# EAGLE design main (EAGLE 7.7.0)
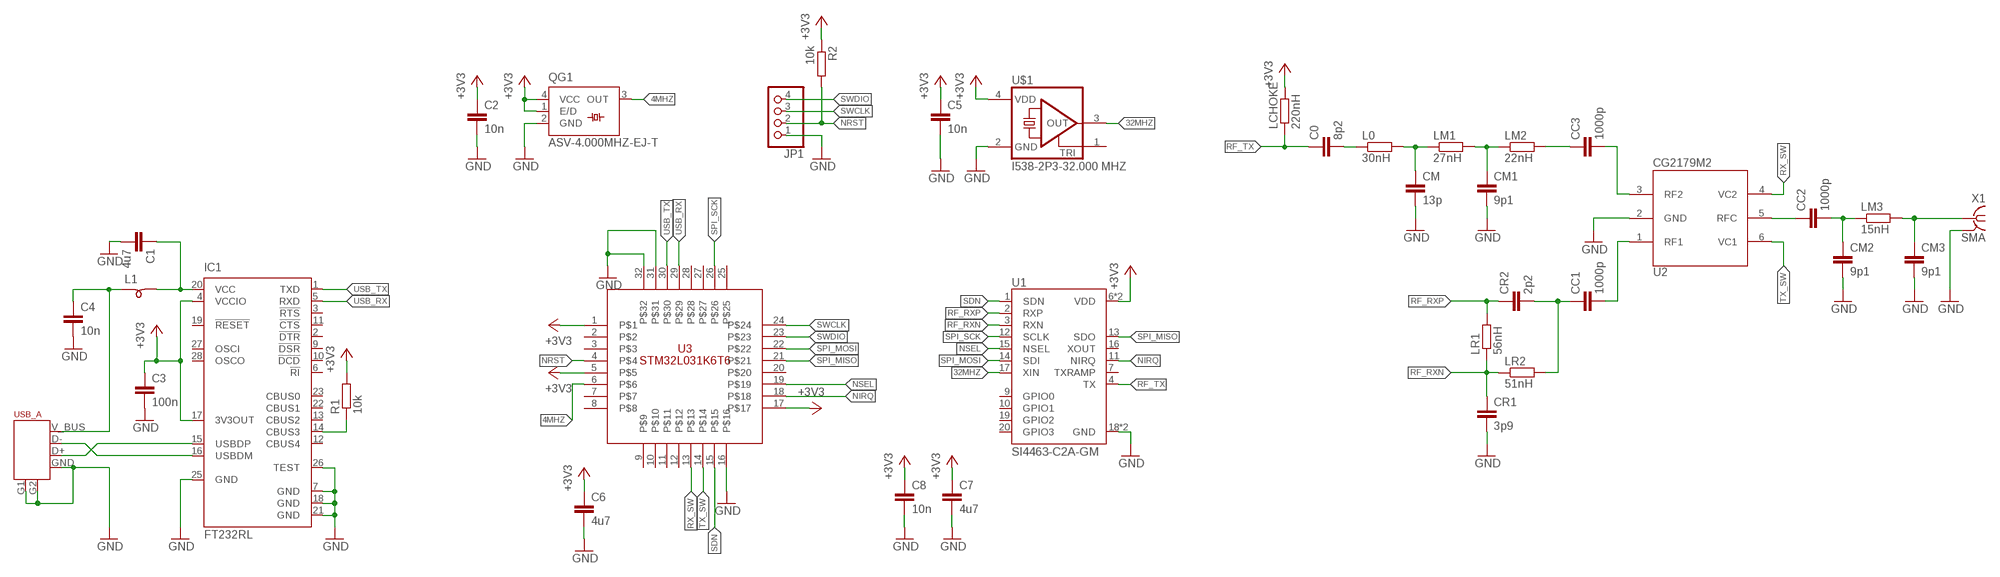
[diagram p0: schematic, sheet 1]

## Parts
C0  8p2  C-EUC0805  [C0805]
C1  4u7  C-EUC1206  [C1206]
C2  10n  C-EUC0805  [C0805]
C3  100n  C-EUC0805  [C0805]
C4  10n  C-EUC0805  [C0805]
C5  10n  C-EUC0805  [C0805]
C6  4u7  C-EUC1206  [C1206]
C7  4u7  C-EUC1206  [C1206]
C8  10n  C-EUC0805  [C0805]
CC1  1000p  C-EUC0805  [C0805]
CC2  1000p  C-EUC0805  [C0805]
CC3  1000p  C-EUC0805  [C0805]
CM  13p  C-EUC0805  [C0805]
CM1  9p1  C-EUC0805  [C0805]
CM2  9p1  C-EUC0805  [C0805]
CM3  9p1  C-EUC0805  [C0805]
CR1  3p9  C-EUC0805  [C0805]
CR2  2p2  C-EUC0805  [C0805]
IC1  FT232RL  [SSOP28]
JP1  PINHD-1X4  [1X04]
L0  30nH  R-EU_R0805  [R0805]
L1  SM-B5  [SM-B5]
LCHOKE  220nH  R-EU_R0805  [R0805]
LM1  27nH  R-EU_R0805  [R0805]
LM2  22nH  R-EU_R0805  [R0805]
LM3  15nH  R-EU_R0805  [R0805]
LR1  56nH  R-EU_R0805  [R0805]
LR2  51nH  R-EU_R0805  [R0805]
QG1  ASV-4.000MHZ-EJ-T  SM77H  [SM77H]
R1  10k  R-EU_R0805  [R0805]
R2  10k  R-EU_R0805  [R0805]
U1  SI4463-C2A-GM  [QFN50P400X400X90-20N]
U2  CG2179M2  [SOT363]
U3  STM32L031K6T6  STM32L011  [LQFP32-7X7]
U$1  I538-2P3-32.000 MHZ  ASE  [ASE]
U$2  USB_TYPE_A  [USB_A_THT]
X1  SMA  SMA-142-0711-821/826  [J502-ND-142-0711-821/826]

## Nets
4MHZ: QG1.3(OUT) U3.6
32MHZ: U1.17(XIN) U$1.3(OUT)
+3V3: C2.1 C3.1 C5.1 C6.1 C7.1 C8.1 IC1.4(VCCIO) IC1.17(3V3OUT) LCHOKE.2 QG1.1(E/D) QG1.4(VCC) R1.2 R2.1 U1.6(VDD) U1.8(VDD) U3.1 U3.5 U3.17 U$1.4(VDD)
GND: C1.2 C2.2 C3.2 C4.2 C5.2 C6.2 C7.2 C8.2 CM1.2 CM2.2 CM3.2 CM.2 CR1.2 IC1.7(GND) IC1.18(GND) IC1.21(GND) IC1.25(GND) IC1.26(TEST) JP1.1 QG1.2(GND) U1.18(GND) U1.21(GND) U2.2(GND) U3.16 U3.31 U3.32 U$1.2(GND) U$2.G1 U$2.G2 U$2.GND X1.G@1 X1.G@2 X1.G@3 X1.G@4
N$2: CC3.1 LM2.2
N$3: IC1.15(USBDP) U$2.D+
N$4: IC1.16(USBDM) U$2.D-
N$5: C4.1 L1.1 U$2.V_BUS
N$6: C1.1 IC1.20(VCC) L1.2
N$8: IC1.14(CBUS3) R1.1
N$9: CC3.2 U2.3(RF2)
N$21 [rf]: CM3.1 LM3.2 X1.1
N$22 [rf]: CC2.2 CM2.1 LM3.1
N$23 [rf]: C0.2 L0.1
N$24 [rf]: CM.1 L0.2 LM1.1
N$25 [rf]: CM1.1 LM1.2 LM2.1
N$29: CC1.1 CR2.2 LR2.2
N$31: CC1.2 U2.1(RF1)
N$32 [rf]: CC2.1 U2.5(RFC)
NIRQ: U1.11(NIRQ) U3.18
NRST: JP1.2 R2.2 U3.4
NSEL: U1.15(NSEL) U3.19
RF_RXN: CR1.1 LR1.1 LR2.1 U1.3(RXN)
RF_RXP: CR2.1 LR1.2 U1.2(RXP)
RF_TX: C0.1 LCHOKE.1 U1.4(TX)
RX_SW: U2.4(VC2) U3.13
SDN: U1.1(SDN) U3.15
SPI_MISO: U1.13(SDO) U3.21
SPI_MOSI: U1.14(SDI) U3.22
SPI_SCK: U1.12(SCLK) U3.26
SWCLK: JP1.3 U3.24
SWDIO: JP1.4 U3.23
TX_SW: U2.6(VC1) U3.14
USB_RX: IC1.5(RXD) U3.29
USB_TX: IC1.1(TXD) U3.30
Unconnected: IC1.2(!DTR) IC1.3(!RTS) IC1.6(!RI) IC1.9(!DSR) IC1.10(!DCD) IC1.11(!CTS) IC1.12(CBUS4) IC1.13(CBUS2) IC1.19(!RESET) IC1.22(CBUS1) IC1.23(CBUS0) IC1.27(OSCI) IC1.28(OSCO) U1.7(TXRAMP) U1.9(GPIO0) U1.10(GPIO1) U1.16(XOUT) U1.19(GPIO2) U1.20(GPIO3) U3.2 U3.3 U3.7 U3.8 U3.9 U3.10 U3.11 U3.12 U3.20 U3.25 U3.27 U3.28 U$1.1(TRI)

## Library data of the parts
C0 C1-C8 CC1-CC3 CM CM1-CM3 CR1 CR2 = rcl:C-EU: CAPACITOR, European symbol
IC1 = ftdichip:FT232R: Source: http://www.ftdichip.com/Documents/DataSheets/DS_FT232R_v104.pdf; MPN: FT232RL; OC_FARNELL: 1146032; OC_NEWARK: 91K9918
JP1 = pinhead:PINHD-1X4: PIN HEADER
L0 LCHOKE LM1-LM3 LR1 LR2 R1 R2 = resistor:R-EU_: RESISTOR, European symbol
L1 = inductor-neosid:SM-B: INDUCTOR SMD Bead inductor; OC_FARNELL: unknown; OC_NEWARK: unknown
QG1 = crystal:SM77H: 3.3V CMOS Clock Oscillator Source: www.pletronics.com .. sm77h%203.3v.pdf; OC_FARNELL: unknown; OC_NEWARK: unknown
U1 = SI4463-C2A-GM:SI4463-C2A-GM: RF Transceiver FSK/GFSK/GMSK/MSK/OOK 3.3V 20-Pin QFN EP; AVAILABILITY: Unavailable; DESCRIPTION: RF Transceiver FSK/GFSK/GMSK/MSK/OOK 3.3V 20-Pin QFN EP; MF: Silicon Labs; MP: SI4463-C2A-GM; PACKAGE: VFQFN-20 Silicon Labs; PRICE: None
U2 = CG2179M2:CG2179M2
U3 = STM32L011:STM32L011
U$1 = crystal:ASE: 3.3Vdc CMOS SMD CRYSTAL CLOCK OSCILLATOR SOurce: www.abracon.com; OC_FARNELL: unknown; OC_NEWARK: unknown
U$2 = USB_A:USB_TYPE_A
X1 = con-coax:SMA-: SMA 50 Ohm End Launch Jack Receptacle - Round Contact Johnson Components Source: www.johnsoncomponents.com .. J502-ND.pdf; MF: JOHNSON COMPONENTS; MPN: 142-0711-821; OC_FARNELL: 1019328; OC_NEWARK: 16F3627

## Net classes
1 pwr: width 0.5 mm, drill 0.2 mm, clearance 0.127 mm
2 rf: width 0.5 mm, drill 0.2 mm, clearance 0.127 mm

## Board
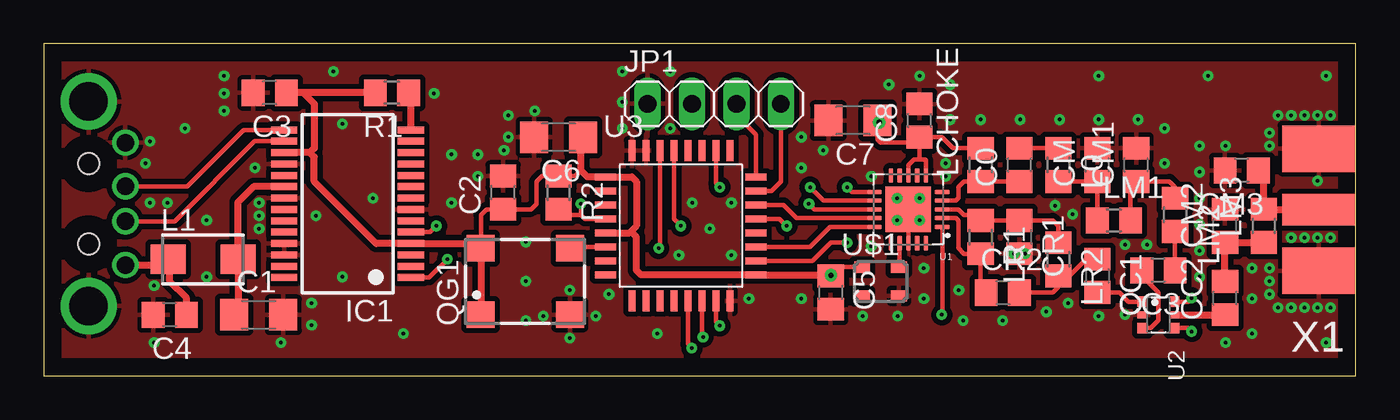
[diagram p1: board, top side]
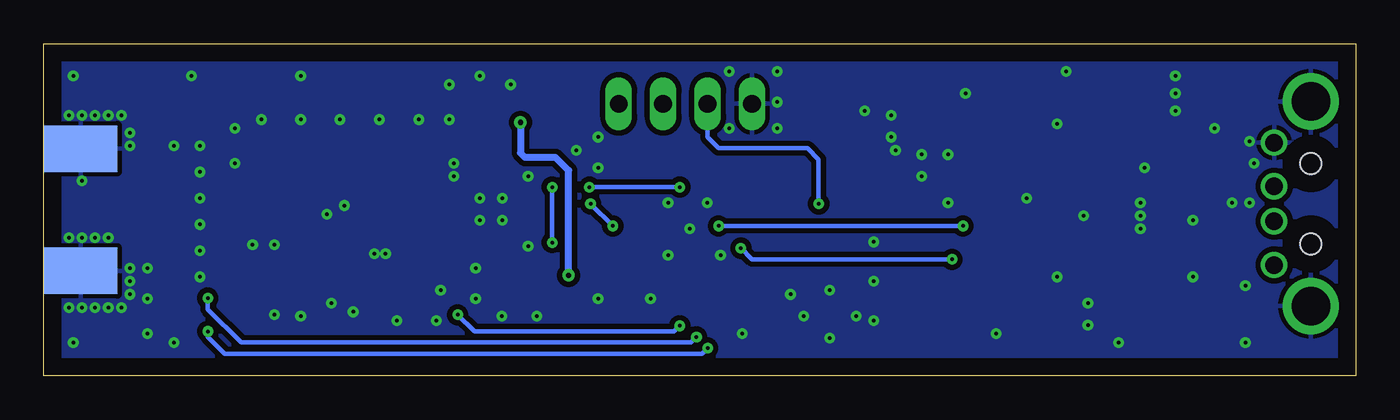
[diagram p2: board, bottom side, seen from below]

Size 75 x 19 mm. Coordinates in mm from the lower left corner, seen from the top.
Outline: 0,0 75,0 75,19 0,19 0,0
Copper layers (1*16): Top 0.035mm / dielectric 1.5mm / Bottom 0.035mm
Design rules "default *": minimum track width 10mil, minimum drill 24mil, track to track 8mil, track to pad 8mil, pad to pad 8mil, via to via 8mil, smd to smd 8mil, copper to edge 40mil, drill to drill 8mil, minimum pad ring 10mil, minimum via ring 8mil, stop-mask expansion 4mil, vias tented up to drill 0.3mm, thermal gap 10mil

### Footprints (pad centres in the part's own frame; a part is rotated, then mirrored left to right if it is on the bottom)
C0805 = smd 1.3 x 1.5: 1 -0.95,0; 2 0.95,0
C1206 = smd 1.6 x 1.8: 1 -1.4,0; 2 1.4,0
SSOP28 = smd 0.4 x 1.5: 1 -4.225,-3.625; 2 -3.575,-3.625; 3 -2.925,-3.625; 4 -2.275,-3.625; 5 -1.625,-3.625; 6 -0.975,-3.625; 7 -0.325,-3.625; 8 0.325,-3.625; 9 0.975,-3.625; 10 1.625,-3.625; 11 2.275,-3.625; 12 2.925,-3.625; 13 3.575,-3.625; 14 4.225,-3.625; 15 4.225,3.625; 16 3.575,3.625; 17 2.925,3.625; 18 2.275,3.625; 19 1.625,3.625; 20 0.975,3.625; 21 0.325,3.625; 22 -0.325,3.625; 23 -0.975,3.625; 24 -1.625,3.625; 25 -2.275,3.625; 26 -2.925,3.625; 27 -3.575,3.625; 28 -4.225,3.625
1X04 = drill 1.016 long: 1 -3.81,0; 2 -1.27,0; 3 1.27,0; 4 3.81,0
R0805 = smd 1.3 x 1.5: 1 -0.95,0; 2 0.95,0
SM-B5 = smd 2 x 1.7: 1 -2,0; 2 2,0
SM77H = smd 1.6 x 1.5: 1 -2.55,-1.9; 2 2.55,-1.9; 3 2.55,1.9; 4 -2.55,1.9
QFN50P400X400X90-20N = smd 0.84 x 0.26: 1 -1.935,1; 2 -1.935,0.5; 3 -1.935,0; 4 -1.935,-0.5; 5 -1.935,-1; 11 1.935,-1; 12 1.935,-0.5; 13 1.935,0; 14 1.935,0.5; 15 1.935,1 | smd 0.26 x 0.84: 6 -1,-1.935; 7 -0.5,-1.935; 8 0,-1.935; 9 0.5,-1.935; 10 1,-1.935; 16 1,1.935; 17 0.5,1.935; 18 0,1.935; 19 -0.5,1.935; 20 -1,1.935 | smd 2.6 x 2.6: 21 0,0
SOT363 = smd 0.6 x 0.6: 1 -0.75,-0.9; 3 0.75,-0.9; 4 0.75,0.9; 6 -0.75,0.9 | smd 0.4 x 0.6: 2 0,-0.9; 5 0,0.9
LQFP32-7X7 = smd 1.2 x 0.4: 1 -4.3,2.8; 2 -4.3,2; 3 -4.3,1.2; 4 -4.3,0.4; 5 -4.3,-0.4; 6 -4.3,-1.2; 7 -4.3,-2; 8 -4.3,-2.8; 17 4.3,-2.8; 18 4.3,-2; 19 4.3,-1.2; 20 4.3,-0.4; 21 4.3,0.4; 22 4.3,1.2; 23 4.3,2; 24 4.3,2.8 | smd 0.4 x 1.2: 9 -2.8,-4.3; 10 -2,-4.3; 11 -1.2,-4.3; 12 -0.4,-4.3; 13 0.4,-4.3; 14 1.2,-4.3; 15 2,-4.3; 16 2.8,-4.3; 25 2.8,4.3; 26 2,4.3; 27 1.2,4.3; 28 0.4,4.3; 29 -0.4,4.3; 30 -1.2,4.3; 31 -2,4.3; 32 -2.8,4.3
ASE = smd 0.9 x 0.65: 1 -1.05,-0.825; 2 1.05,-0.825; 3 1.05,0.825; 4 -1.05,0.825
USB_A_THT = drill 1: D+ -1,0; D- 1,0; GND -3.5,0; V_BUS 3.5,0 | drill 2.2: G1 -5.85,-2.1; G2 5.85,-2.1 | hole 1.2: -2.3,-2.1; 2.3,-2.1
J502-ND-142-0711-821/826 = smd 4.191 x 1.778: 1 2.115,0 | smd 4.191 x 2.667: G@1 2.115,3.495; G@2 2.115,-3.495 | smd 4.191 x 2.667 bottom: G@3 2.115,3.495; G@4 2.115,-3.495

### Placement (x,y rotation side)
C0  55.78,12.06 90 top
C1  12.29,3.49 0 top
C2  26.26,10.48 90 top
C3  12.92,16.19 180 top
C4  7.21,3.49 180 top
C5  44.98,4.76 270 top
C6  29.43,13.65 180 top
C7  46.25,14.61 180 top
C8  50.06,14.61 90 top
CC1  60.22,5.71 270 top
CC2  67.53,4.45 90 top
CC3  63.72,6.03 180 top
CM  60.22,12.06 90 top
CM1  62.45,12.06 90 top
CM2  67.53,8.57 90 top
CM3  68.48,11.75 180 top
CR1  55.78,7.94 270 top
CR2  54.83,4.76 0 top
IC1  17.37,9.84 90 top
JP1  38.32,15.56 0 top
L0  58,12.06 270 top
L1  9.11,6.67 0 top
LCHOKE  53.55,12.06 90 top
LM1  61.17,8.89 0 top
LM2  64.67,9.21 270 top
LM3  69.75,8.57 90 top
LR1  53.55,7.94 270 top
LR2  58,6.67 270 top
QG1  27.53,5.4 0 top
R1  19.91,16.19 180 top
R2  29.43,10.48 270 top
U1  49.43,9.53 180 top
U2  63.72,3.49 270 top
U3  36.42,8.57 0 top
U$1  47.84,5.4 0 top
U$2  4.67,9.84 270 top
X1  75,9.5 180 top

### Tracks (layer width: path | path; a pad name or v marks a point on that pad's centre or on a via)
4MHZ
  Top 0.254: U3.6 30.15,7.37 QG1.3
32MHZ
  Top 0.254: U1.17 48.93,6.26 U$1.3
+3V3  (via drill 0.3 pad 0.25)
  Top 0.254: 30.7,11.75 30.38,11.43 R2.1 28.48,11.43 28.16,11.11 28.16,9.84 27.85,9.53 C2.1 25.31,9.53 24.99,9.21 QG1.4 | U1.8 49.43,12.06 49.74,12.38 50.06,12.38 | U1.6 50.43,12.34 50.38,12.38 50.06,12.38 | C8.1 50.06,12.38 | C7.1 47.65,13.52 47.84,13.34 49.74,13.34 C8.1 | LCHOKE.2 51.97,13.02 51.33,13.65 C8.1 | U$1.4 45.49,6.22 C5.1 44.92,5.77
  Top 0.406: 15.21,12.77 15.46,13.02 15.46,15.56 14.83,16.19 | 15.21,12.77 IC1.17 | 15.21,12.77 15.46,12.52 15.46,11.11 19.01,7.57 IC1.4 24.71,7.57 QG1.4 | 14.83,16.19 C3.1 | R1.2 14.83,16.19 | C6.1 30.7,13.52 30.7,11.75 31.08,11.37 U3.1 33.62,11.37 33.88,11.11 33.88,8.57 33.56,8.26 | U3.5 33.48,8.17 33.56,8.26 | QG1.4 QG1.1 | 33.56,8.26 33.88,7.94 33.88,6.03 34.14,5.77 U3.17 44.92,5.77 | v47.75,14.5 v47.75,14.51 C7.1 | C5.1 44.98,5.73 v45,5.75
  Bottom 0.406: v45,5.75 45,11.75 45.75,12.5 47.5,12.5 47.75,12.75 v47.75,14.5
GND  (via drill 0.2 pad 0.25)
  Top 0.254: U1.18 U1.21 v50.06,8.89
  other vias: 55.46,6.99 56.09,6.99 61.81,3.49 48.79,10.16 50.06,10.16 48.79,8.89 72.81,3.91 73.56,3.91 72.06,3.91 71.31,3.91 70.56,3.91 70.06,4.66 70.06,5.41 70.06,6.16 71.31,7.91 73.56,7.91 72.81,7.91 72.06,7.91 73.56,14.91 72.81,14.91 72.06,14.91 71.31,14.91 70.56,14.91 70.06,13.16 70.06,13.91 72.81,11.16 67.56,13.16 66.06,11.66 66.06,13.16 66.06,10.16 66.06,8.66 66.06,7.16 66.06,5.66 69.06,6.16 69.06,4.41 69.06,2.41 67.56,1.91 60.31,3.41 58.56,4.16 57.31,3.66 54.81,3.16 52.56,3.16 52.31,4.91 61.81,7.49 63.06,7.49 58.81,9.24 57.81,9.74 50.31,6.16 50.31,4.41 48.81,3.41 46.81,3.41 47.31,7.41 47.31,11.41 51.56,11.41 51.56,12.16 64.06,12.16 62.56,14.66 60.31,14.66 58.06,14.66 55.81,14.66 53.56,14.66 51.81,14.66 64.06,14.16 50.06,17.16 51.81,16.66 48.31,16.66 43.31,13.66 44.56,12.91 43.31,11.91 33.06,17.41 35.81,17.41 33.06,14.16 35.81,14.16 28.06,15.16 26.56,13.66 26.56,14.91 26.31,12.91 24.81,11.41 24.81,12.66 23.31,9.91 23.31,12.66 22.31,16.16 16.56,17.41 17.06,14.41 18.81,10.16 15.56,9.16 17.06,5.66 6.06,13.41 5.81,12.16 10.31,16.16 8.06,14.16 10.31,17.16 10.31,15.16 12.06,11.91 9.31,8.91 9.31,5.66 6.31,1.91 13.56,1.91 6.31,5.16 15.31,4.16 15.31,2.91 20.56,2.41 12.31,9.16 12.31,8.41 12.31,9.91 30.06,2.16 28.56,3.41 31.56,3.41 30.06,4.91 27.56,7.66 32.31,4.66 27.56,3.16 27.56,5.41 35.06,2.41 40.31,4.41 43.31,4.41 36.31,6.91 39.31,6.91 38.06,8.41 39.31,9.91 37.06,9.91 33.06,15.66 73.31,17.16 60.31,17.16 66.56,17.16 73.31,1.91 6.06,9.91 7.06,9.91
  pour Top (isolate 0.3): -0.5,-0.5 75.25,-0.5 75.25,19.5 -0.5,19.5
  pour Bottom (isolate 0.3): -0.5,19.5 75.25,19.5 75.25,-0.5 -0.5,-0.5
N$2
  Top 0.254: LM2.2 CC3.1
N$3
  Top 0.254: IC1.15 11.43,14.07 8.21,10.84 U$2.D+
N$4
  Top 0.254: IC1.16 12.05,13.42 7.48,8.84 U$2.D-
N$5
  Top 0.406: U$2.V_BUS 6.79,6.34 L1.1 7.21,6.57 7.21,5.4 8.16,4.45 C4.1
N$6
  Top 0.406: C1.1 11.11,3.72 L1.2 11.11,9.94 11.99,10.82 IC1.20
N$8
  Top 0.406: IC1.14 20.99,16.06 R1.1
N$9
  Top 0.254: CC3.2 62.77,5.71 63.72,4.76 63.72,3.17 63.28,2.74 U2.3
N$21
  Top 0.254: 69.75,11.43 CM3.1
  Top 0.406: 69.75,11.43 LM3.2 72.86,9.52 X1.1
N$22
  Top 0.406: CC2.2 CM2.1 LM3.1
N$23
  Top 0.254: C0.2 L0.1
N$24
  Top 0.254: L0.2 CM.1 LM1.1
N$25
  Top 0.254: LM1.2 62.12,10.79 CM1.1 64.35,11.12 64.67,10.79 LM2.1
N$29
  Top 0.254: CC1.1 59.59,6.67 58.63,5.71 LR2.2 58,5.08 57.68,4.76 CR2.2
N$31
  Top 0.254: U2.1 62.01,4.24 61.49,4.76 CC1.2
N$32
  Top 0.254: CC2.1
  Top 0.406: U2.5 CC2.1
NIRQ  (via drill 0.2 pad 0.25)
  Top 0.254: U3.18 43.94,6.57 44.99,7.62 v45.94,7.62 | U1.11 46.2,10.53 v45.94,10.79
  Bottom 0.254: v45.94,10.79 v45.94,7.62
NRST  (via drill 0.2 pad 0.25)
  Top 0.254: U3.4 30.94,8.97 30.7,9.21 | 30.7,9.21 v30.7,9.84 | 30.7,9.21 29.75,9.21 R2.2
  Bottom 0.254: JP1.2 37.05,13.65 36.42,13.02 31.34,13.02 30.7,12.38 v30.7,9.84
NSEL
  Top 0.254: U1.15 44.94,8.53 43.79,7.37 U3.19
RF_RXN
  Top 0.254: LR2.1 58,8.57 57.69,8.89 CR1.1 LR1.1 53.23,9.21 52.6,9.21 52.28,9.53 U1.3
RF_RXP
  Top 0.254: CR2.1 53.55,5.08 LR1.2 52.6,6.99 52.28,7.3 52.28,8.89 52.15,9.03 U1.2
RF_TX
  Top 0.254: U1.4 52.15,10.03 52.28,10.16 52.28,10.79 52.6,11.12 LCHOKE.1 C0.1
RX_SW  (via drill 0.2 pad 0.25)
  Top 0.254: U2.4 65.42,2.74 v65.62,2.54 | U3.13 36.82,1.82 v37.05,1.59
  Bottom 0.254: v65.62,2.54 65.62,2.22 64.67,1.27 37.37,1.27 v37.05,1.59
SDN  (via drill 0.2 pad 0.25)
  Top 0.254: U3.15 38.42,3.08 v38.64,2.86 | U1.1 51.36,3.52 v51.33,3.49
  Bottom 0.254: v38.64,2.86 38.96,2.54 50.38,2.54 v51.33,3.49
SPI_MISO  (via drill 0.2 pad 0.25)
  Top 0.254: U3.21 42.07,8.97 v42.47,8.57 | U1.13 44.06,9.53 v43.74,9.84
  Bottom 0.254: v43.74,9.84 v42.47,8.57
SPI_MOSI
  Top 0.254: U1.14 43.04,9.03 42.29,9.77 U3.22
SPI_SCK  (via drill 0.2 pad 0.25)
  Top 0.254: U1.12 44.58,10.03 v43.81,10.79 | U3.26 38.42,11.02 v38.64,10.79
  Bottom 0.254: v38.64,10.79 v43.81,10.79
SWCLK
  Top 0.254: U3.24 40.72,13.8 39.59,14.92 JP1.3
SWDIO
  Top 0.254: U3.23 41.59,10.57 42.13,11.11 JP1.4
TX_SW  (via drill 0.2 pad 0.25)
  Top 0.254: U2.6 65.42,4.24 v65.62,4.45 | U3.14 37.62,2.29 v37.69,2.22
  Bottom 0.254: v65.62,4.45 65.62,3.81 63.72,1.91 38.01,1.91 v37.69,2.22
USB_RX  (via drill 0.2)
  Top 0.254: U3.29 36.02,8.97 v36.42,8.57 | IC1.5 22.09,8.22 v22.45,8.57
  Bottom 0.254: v22.45,8.57 v36.42,8.57
USB_TX  (via drill 0.2)
  Top 0.254: U3.30 35.22,7.37 v35.15,7.3 | IC1.1 22.03,5.62 v23.08,6.67
  Bottom 0.254: v23.08,6.67 34.51,6.67 v35.15,7.3

### Text on the board
tDocu: USB | SP5WWP | SWD | M17_ANL_1.0 | RF